# EAGLE schematic opto_isolator (EAGLE 5.00)
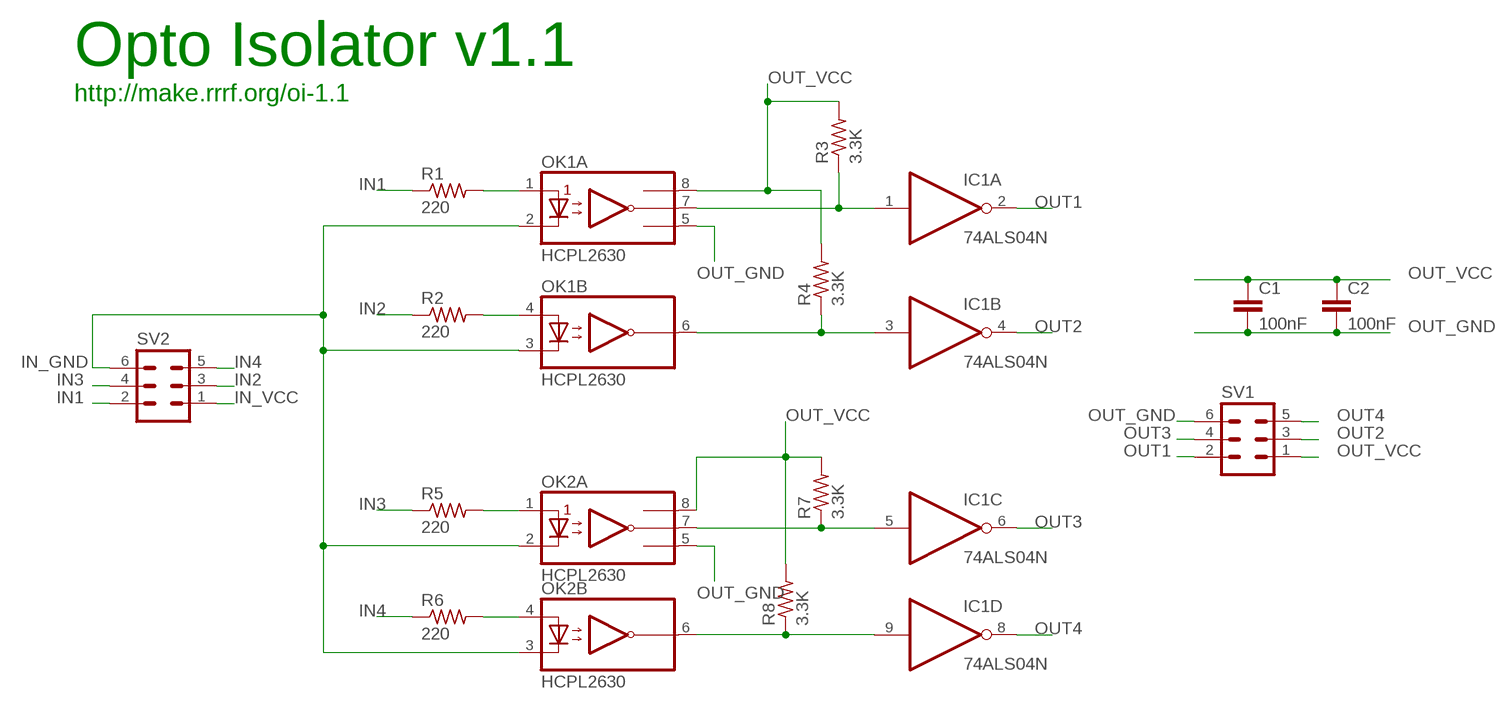
[diagram p0: schematic, sheet 1]

## Parts
C1  100nF  C-EU050-035X075  [C050-035X075]
C2  100nF  C-EU050-035X075  [C050-035X075]
IC1  74ALS04N  [DIL14]
OK1  HCPL2630  [DIL08]
OK2  HCPL2630  [DIL08]
R1  220  R-US_0207/2V  [0207/2V]
R2  220  R-US_0207/2V  [0207/2V]
R3  3.3K  R-US_0207/2V  [0207/2V]
R4  3.3K  R-US_0207/2V  [0207/2V]
R5  220  R-US_0207/2V  [0207/2V]
R6  220  R-US_0207/2V  [0207/2V]
R7  3.3K  R-US_0207/2V  [0207/2V]
R8  3.3K  R-US_0207/2V  [0207/2V]
SV1  ML6  [ML6]
SV2  ML6  [ML6]

## Nets
IN1: R1.1 SV2.2
IN2: R2.1 SV2.3
IN3: R5.1 SV2.4
IN4: R6.1 SV2.5
IN_GND: OK1.2(A:C1) OK1.3(B:C2) OK2.2(A:C1) OK2.3(B:C2) SV2.6
IN_VCC: SV2.1
N$1: OK2.4(B:A2) R6.2
N$2: OK2.1(A:A1) R5.2
N$3: OK1.1(A:A1) R1.2
N$4: OK1.4(B:A2) R2.2
N$5: IC1.5(C:I) OK2.7(A:VO1) R7.1
N$6: IC1.9(D:I) OK2.6(B:VO2) R8.1
N$7: IC1.3(B:I) OK1.6(B:VO2) R4.1
N$8: IC1.1(A:I) OK1.7(A:VO1) R3.1
OUT1: IC1.2(A:O) SV1.2
OUT2: IC1.4(B:O) SV1.3
OUT3: IC1.6(C:O) SV1.4
OUT4: IC1.8(D:O) SV1.5
OUT_GND: C1.2 C2.2 OK1.5(A:GND) OK2.5(A:GND) SV1.6
OUT_VCC: C1.1 C2.1 OK1.8(A:VCC) OK2.8(A:VCC) R3.2 R4.2 R7.2 R8.2 SV1.1
Unconnected: IC1.10(E:O) IC1.11(E:I) IC1.12(F:O) IC1.13(F:I)

## Notes on the sheet
- Opto Isolator v1.1
- http://make.rrrf.org/oi-1.1

## Power pins joined to a net without a drawn wire
GND: IC1.7(P:GND)
VCC: IC1.14(P:VCC)

## Library data of the parts
C1 C2 = rcl:C-EU: CAPACITOR, European symbol
IC1 = 74xx-us:74*04: Hex INVERTER
OK1 OK2 = optocoupler:HCPL2630: HEWLETT PACKARD OPTO COUPLER
R1-R8 = rcl:R-US_: RESISTOR, American symbol
SV1 SV2 = con-harting-ml:ML6: HARTING